# EasyEDA schematic Schemat_easy_eda.json
TITLE: Sheet_1; REV: 1.0; Date: 2021-04-07; Sheet: 1/1; Drawn By: student_try_240712; Company: Your Company
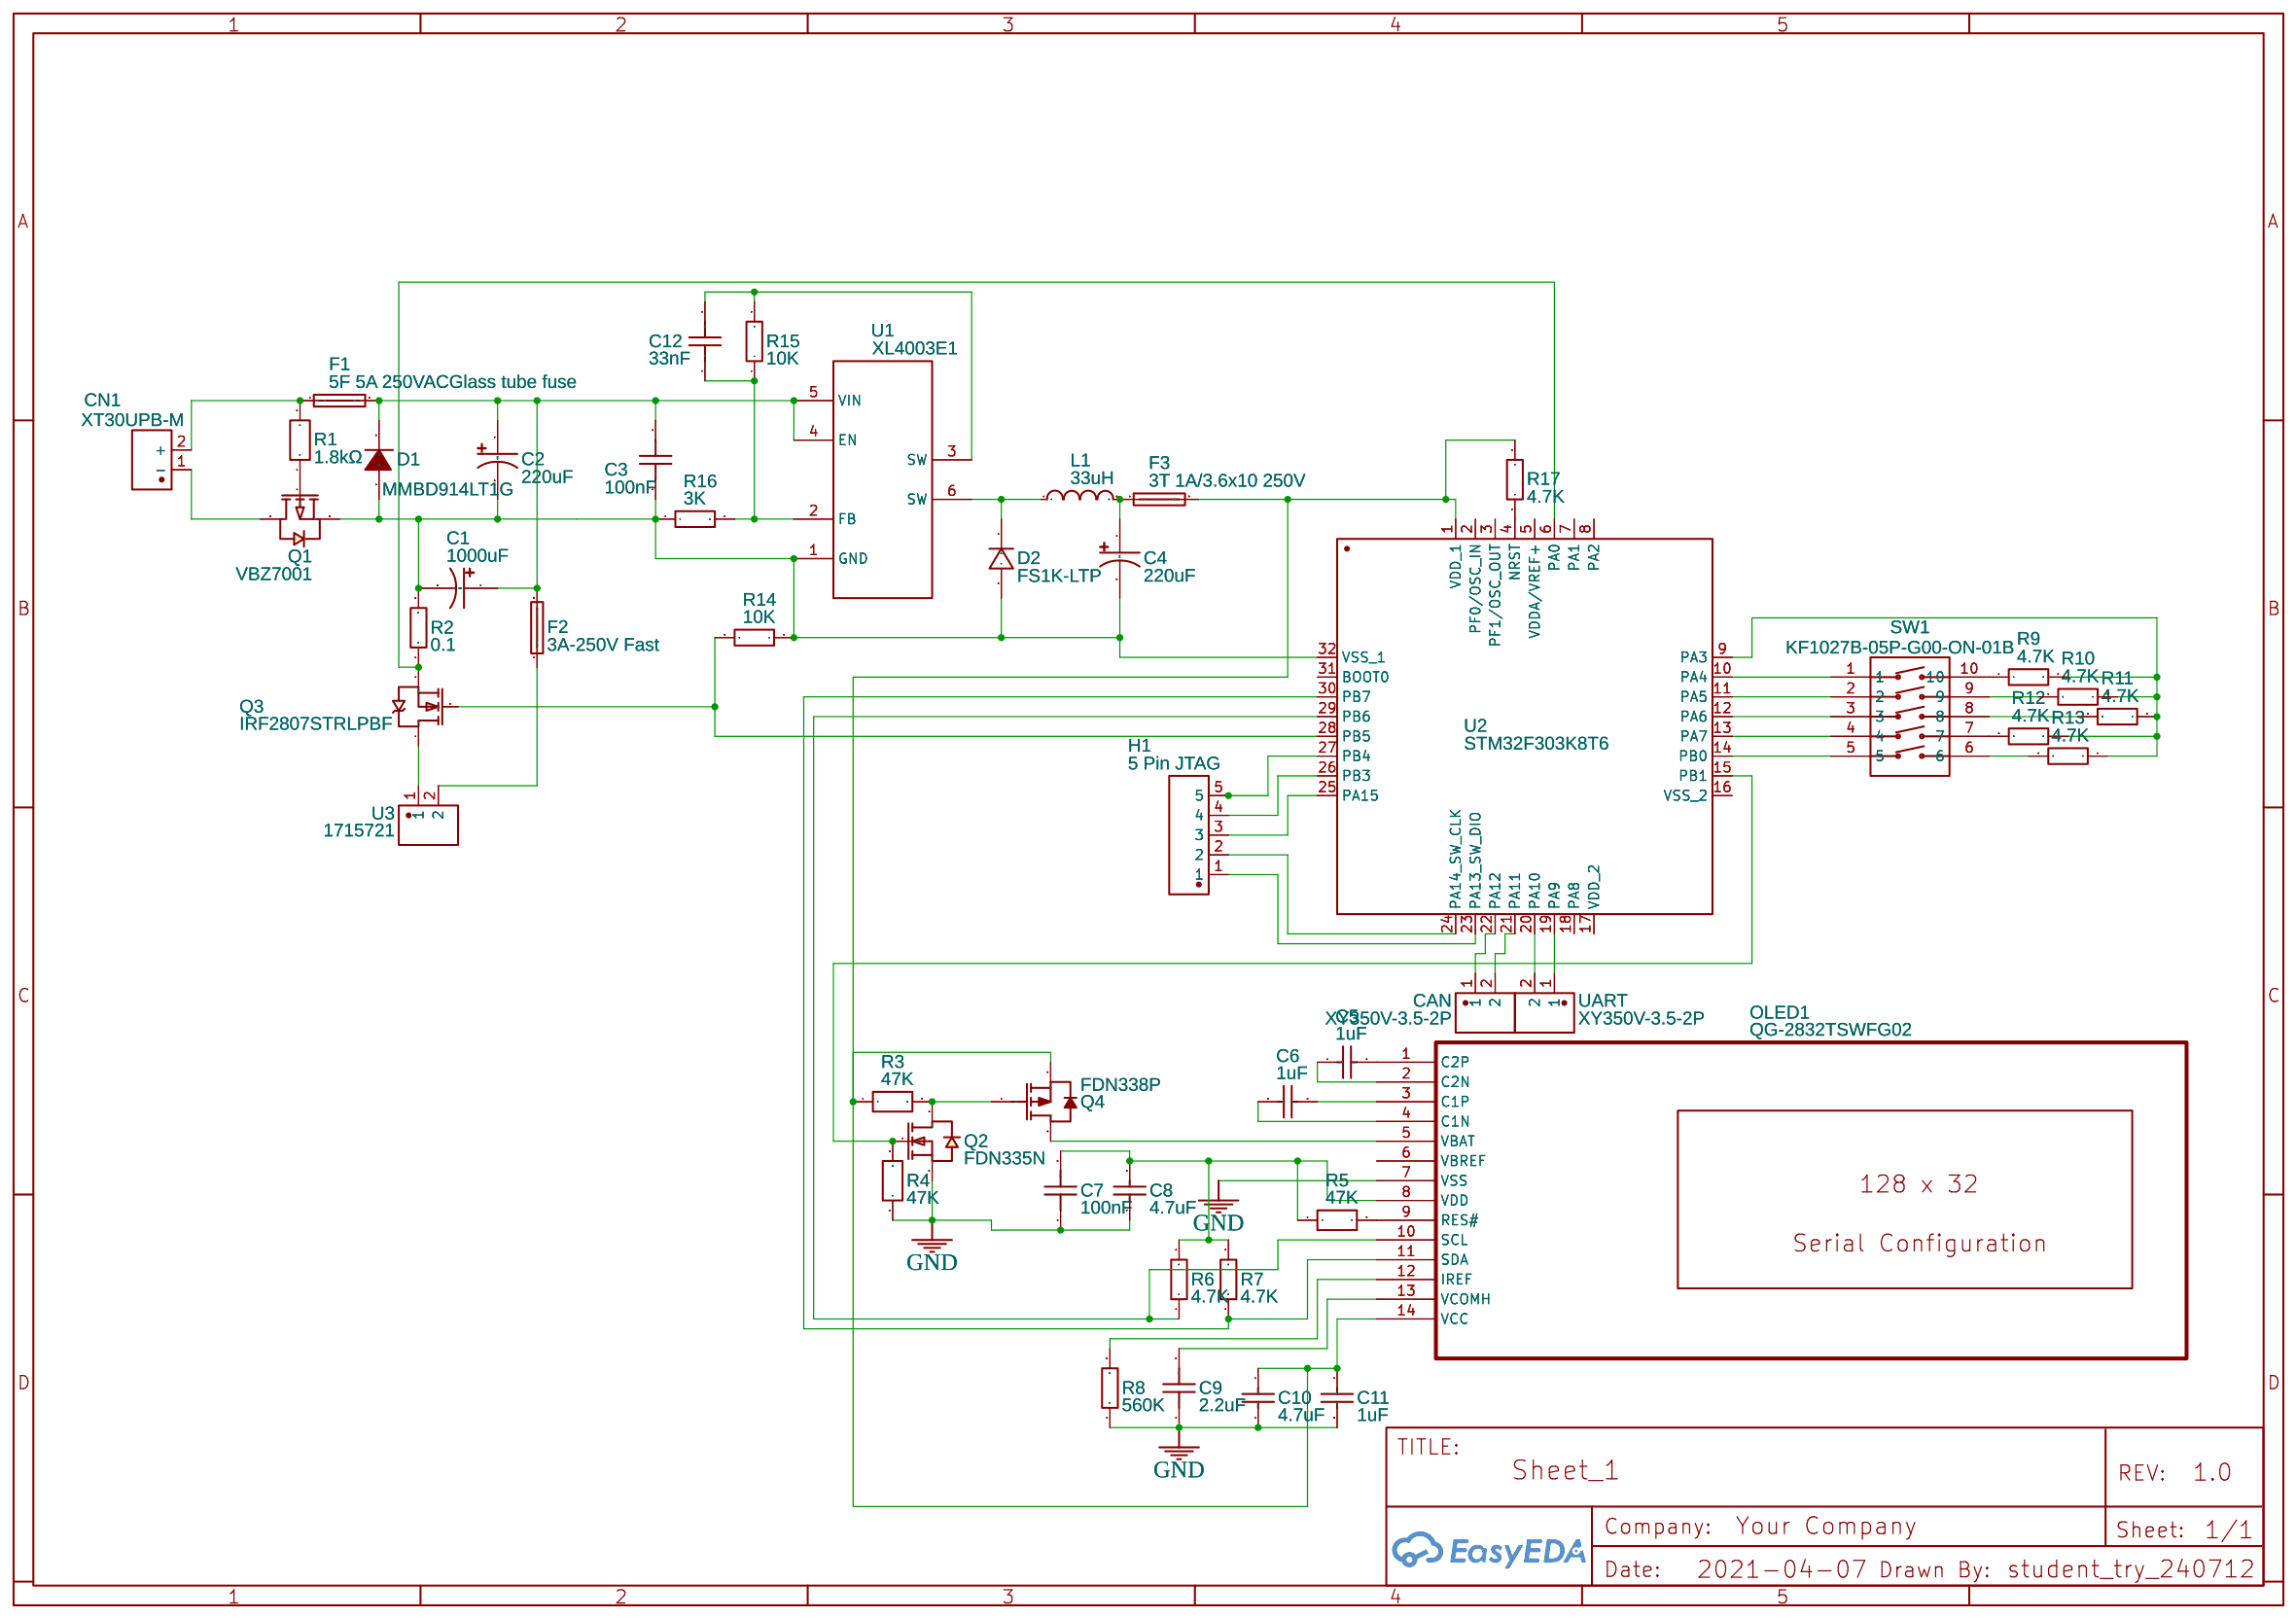
[diagram p0: schematic sheet]

## Parts
C1  1000uF  [CAP-TH_BD10.0-P5.00-D1.0-FD]
C2  220uF  [CAP-SMD_BD10.0-L10.3-W10.3-FD]
C3  100nF  [CAP-TH_L5.0-W2.5-P2.54-D0.7]
C4  220uF  [CAP-SMD_BD6.3-L6.6-W6.6-RD]
C5  1uF  [C0603]
C6  1uF  [C0603]
C7  100nF  [C0402]
C8  4.7uF  [C0805]
C9  2.2uF  [C0603]
C10  4.7uF  [C0805]
C11  1uF  [C0603]
C12  33nF  [CAP-TH_L7.2-W2.5-P5.00-D0.6]
CAN  XY350V-3.5-2P  [CONN-TH_XY350V-3.5-2P]
CN1  XT30UPB-M  [CONN-TH_XT30UPB-M]
D1  MMBD914LT1G  [SOT-23_L2.9-W1.3-P1.90-LS2.4-BR]
D2  FS1K-LTP  [SMA_L4.4-W2.8-LS5.4-RD]
F1  5F 5A 250VACGlass tube fuse  [FUSE-SMD_5-20MM]
F2  3A-250V Fast  [FUSE-TH_BD5.6-L21.0-P25.00-D0.7]
F3  3T 1A/3.6x10 250V  [FUSE-TH_BD4.0-L11.0-P15.00-D0.6]
H1  5 Pin JTAG  [HDR-TH_5P-P2.54-V-M]
L1  33uH  [IND-TH_BD9.0-P3.50-D0.6_VL0810]
OLED1  QG-2832TSWFG02  [OLED-SMD_QG-2832XXX]
Q1  VBZ7001  [SOT-23-3_L2.9-W1.3-P1.90-LS2.4-BR]
Q2  FDN335N  [SOT-23-3_L2.9-W1.3-P1.90-LS2.4-BR]
Q3  IRF2807STRLPBF  [TO-263-2_L10.0-W9.1-P5.08-LS15.2-BR]
Q4  FDN338P  [SOT-23-3_L2.9-W1.6-P1.90-LS2.8-BR]
R1  1.8kΩ  [RES-TH_BD2.5-L6.5-P10.50-D0.6]
R2  0.1  [R2512]
R3  47K  [RES-TH_BD2.4-L6.3-P10.30-D0.6]
R4  47K  [RES-TH_BD2.4-L6.3-P10.30-D0.6]
R5  47K  [RES-TH_BD2.4-L6.3-P10.30-D0.6]
R6  4.7K  [R0402]
R7  4.7K  [R0402]
R8  560K  [R0603]
R9  4.7K  [R0402]
R10  4.7K  [R0402]
R11  4.7K  [R0402]
R12  4.7K  [R0402]
R13  4.7K  [R0402]
R14  10K  [R0402]
R15  10K  [R1210]
R16  3K  [R0603]
R17  4.7K  [R0402]
SW1  KF1027B-05P-G00-ON-01B  [SW-SMD_10P-L13.7-W6.2-P2.54-LS9.9]
U1  XL4003E1  [TO-252-5_L6.6-W5.8-P1.27-TL]
U2  STM32F303K8T6  [LQFP-32_L7.0-W7.0-P0.80-LS9.0-BL]
U3  1715721  [CONN-TH_P5.08_1715721]
UART  XY350V-3.5-2P  [CONN-TH_XY350V-3.5-2P]

## Library data of the parts
C1 = LKME2301V102MF: Supplier: LCSC; Supplier Part: C442887; Manufacturer: Ymin; Contributor: LCSC; LCSC Assembly: Yes; SMT Type: Extend; Paste Type: expand
C2 = RVE1V221M1010: Supplier: LCSC; Manufacturer: HONOR; Supplier Part: C88670
C3 = CC1H104ZA1FD3F5P10MF: Supplier: LCSC; Supplier Part: C254089; Manufacturer: Dersonic; Contributor: LCSC; LCSC Assembly: Yes; SMT Type: Extend; Paste Type: expand
C4 = VE-221M0JTR-0605: Supplier: LCSC; Supplier Part: C134730; Manufacturer: Lite-On Semicon; Contributor: LCSC; SMT Type: Extend; JLCPCB SMD: Yes; LCSC Assembly: Yes; Paste Type: expand
C5 C6 C11 = CL10B105KA8NNNC: Supplier: LCSC; Manufacturer: SAMSUNG; Supplier Part: C29936; SMT Type: Extend; JLCPCB SMD: Yes; LCSC Assembly: Yes; Paste Type: expand
C7 = GRM155F11C104ZA01D: Supplier: LCSC; Manufacturer: MuRata; Supplier Part: C85954
C8 C10 = C2012X7R1A475KT000N: Supplier: LCSC; Manufacturer: TDK; Supplier Part: C76639
C9 = GRM188R6YA225KA12D: Supplier: LCSC; Manufacturer: MuRata; Supplier Part: C86017
C12 = SMEC333J100M1: Supplier: LCSC; Supplier Part: C401102; Manufacturer: CHAMPION; Contributor: LCSC; LCSC Assembly: Yes; SMT Type: Extend; Paste Type: expand
CAN UART = XY350V-3.5-2P: Supplier: LCSC; Supplier Part: C784942; Manufacturer: Ningbo Xinlaiya Elec.; Contributor: LCSC; LCSC Assembly: Yes; SMT Type: Extend; Paste Type: expand
CN1 = XT30UPB-M: Supplier: LCSC; Supplier Part: C428721; Manufacturer: Changzhou Amass Elec; Contributor: LCSC; LCSC Assembly: Yes; SMT Type: Extend; Paste Type: expand
D1 = MMBD914LT1G: Supplier: LCSC; Manufacturer: ON; image: //image.lceda.cn/szlcsc/C46523.jpg; Supplier Part: C46523; SMT Type: Extend; JLCPCB SMD: Yes; Paste Type: expand
D2 = FS1K-LTP: Supplier: LCSC; Supplier Part: C725310; Manufacturer: MCC(Micro Commercial Components); SMT Type: Extend; Contributor: LCSC; JLCPCB SMD: Yes; LCSC Assembly: Yes; Paste Type: expand
F1 = 5F 5A 250VACGlass tube fuse: Supplier: LCSC; Manufacturer: XCFuse; image: //image.lceda.cn/szlcsc/C3120.jpg; Supplier Part: C3120
F2 = 3A-250V: Supplier: LCSC; Manufacturer Part: 保险管3A-250V,带引脚 双帽; Manufacturer: XCFuse; Supplier Part: C47403; LCSC Assembly: Yes; SMT Type: Extend; Paste Type: expand
F3 = 3T 1A/3.6x10 250V: Supplier: LCSC; Manufacturer: XCFuse; image: //image.lceda.cn/szlcsc/C40879.jpg; Supplier Part: C40879; LCSC Assembly: Yes; SMT Type: Extend; Paste Type: expand
H1 = 210-81-05GB01: Supplier: LCSC; Supplier Part: C390676; Manufacturer: PINREX; Contributor: LCSC; Paste Type: expand
L1 = VLU0810-330K: Supplier: LCSC; Manufacturer: FH; Supplier Part: C72622; LCSC Assembly: Yes; SMT Type: Extend; Paste Type: expand
OLED1 = QG-2832TSWFG02: Supplier: LCSC; Manufacturer: Allvision; Supplier Part: C91219
Q1 = VBZ7001: Supplier: LCSC; Supplier Part: C699531; Manufacturer: VBsemi(台湾微碧); Paste Type: Extended Part; JLCPCB Part Class: Extended Part; Contributor: LCSC
Q2 = FDN335N: Supplier: LCSC; Supplier Part: C347512; Manufacturer: UMW(友台半导体); Contributor: LCSC
Q3 = IRF2807STRLPBF: Supplier: LCSC; Supplier Part: C97742; Manufacturer: Infineon Technologies; Contributor: LCSC; SMT Type: Extend; JLCPCB SMD: Yes; LCSC Assembly: Yes; Paste Type: expand
Q4 = FDN338P: Supplier: LCSC; Manufacturer: FAIRCHILD; Supplier Part: C24855; SMT Type: Extend; JLCPCB SMD: Yes; LCSC Assembly: Yes; Paste Type: expand
R1 = CF1/4W-1.8KΩ±5%T52: Supplier: LCSC; Supplier Part: C714304; Manufacturer: Huaxing Mechanical-Elec.; Contributor: LCSC
R2 = MRF6432(2512)LR100JTS: Supplier: LCSC; Manufacturer: SUP; Supplier Part: C76282; SMT Type: Extend; JLCPCB SMD: Yes; LCSC Assembly: Yes; Paste Type: expand
R3-R5 = RN 1/4W 47K F T/B A1: Supplier: LCSC; Supplier Part: C410613; Manufacturer: TyoHM; Contributor: LCSC; LCSC Assembly: Yes; SMT Type: Extend; Paste Type: expand
R6 R7 R9-R13 R17 = RM04JTN472: Supplier: LCSC; Manufacturer: TA-I; Contributor: LCSC; Supplier Part: C147813
R8 = AECR0603F560KK9: Supplier: LCSC; Supplier Part: C352308; Manufacturer: ResistorToday; Contributor: LCSC
R14 = NQ02WGF1002TCE: Supplier: LCSC; Supplier Part: C270381; Manufacturer: Uniroyal Elec; Contributor: LCSC; SMT Type: Extend; JLCPCB SMD: Yes; LCSC Assembly: Yes; Paste Type: expand
R15 = 1210W3J0103T5E: Supplier: LCSC; Manufacturer: UniOhm; Supplier Part: C25672; Paste Type: expand
R16 = 0603WAJ0302T5E: Supplier: LCSC; Manufacturer: UniOhm; Supplier Part: C25597; Paste Type: expand
SW1 = KF1027B-05P-G00-ON-01B: Supplier: LCSC; Supplier Part: C976367; Manufacturer: 凯峰; Contributor: LCSC
U1 = XL4003E1: Supplier: LCSC; Manufacturer: XLSEMI; image: //image.lceda.cn/szlcsc/C55888.jpg; Supplier Part: C55888; Paste Type: expand
U2 = STM32F303K8T6: Supplier: LCSC; Manufacturer: STMicroelectronics; Supplier Part: C118318; SMT Type: Extend; JLCPCB SMD: Yes; LCSC Assembly: Yes; Paste Type: expand
U3 = 1715721: Supplier: LCSC; Supplier Part: C480516; Manufacturer: Phoenix Contact; Contributor: LCSC; LCSC Assembly: Yes; SMT Type: Extend; Paste Type: expand

## Nets
GND: C7.1 C8.1 C9.1 C10.1 C11.1 OLED1.7(VSS) Q2.2(S) R4.1 R8.1
Net-(C1-1): C1.1 C2.1 C3.2 D1.3(K) F1.2 F2.2 U1.4(EN) U1.5(VIN)
Net-(C1-2): C1.2 C2.2 C3.1 C4.2 D1.1(A) D2.2(A) Q1.2(S) R2.2 R14.1 R16.1 U1.1(GND) U2.32(VSS_1)
Net-(C4-1): C4.1 F3.1 L1.2
Net-(C5-1): C5.1 OLED1.2(C2N)
Net-(C5-2): C5.2 OLED1.1(C2P)
Net-(C6-1): C6.1 OLED1.4(C1N)
Net-(C6-2): C6.2 OLED1.3(C1P)
Net-(C7-2): C7.2 C8.2 OLED1.8(VDD) R5.1 R6.2 R7.2
Net-(C9-2): C9.2 OLED1.13(VCOMH)
Net-(C10-2): C10.2 C11.2 F3.2 OLED1.14(VCC) Q4.2(S) R3.1 R17.2 U2.1(VDD)
Net-(C12-1): C12.1 R15.1 R16.2 U1.2(FB)
Net-(C12-2): C12.2 R15.2 U1.3(SW)
Net-(CAN-1): CAN.1 U2.22(PA12)
Net-(CAN-2): CAN.2 U2.21(PA11)
Net-(CN1-1): CN1.1(-) Q1.3(D)
Net-(CN1-2): CN1.2(+) F1.1 R1.2
Net-(D2-1): D2.1(C) L1.1 U1.6(SW)
Net-(F2-1): F2.1 U3.2
Net-(H1-1): H1.1 U2.23(PA13 SW DIO)
Net-(H1-2): H1.2 U2.24(PA14 SW CLK)
Net-(H1-3): H1.3 U2.25(PA15)
Net-(H1-4): H1.4 U2.26(PB3)
Net-(H1-5): H1.5 U2.27(PB4)
Net-(OLED1-5): OLED1.5(VBAT) Q4.3(D)
Net-(OLED1-9): OLED1.9(RES#) R5.2
Net-(OLED1-10): OLED1.10(SCL) R6.1 U2.29(PB6)
Net-(OLED1-11): OLED1.11(SDA) R7.1 U2.30(PB7)
Net-(OLED1-12): OLED1.12(IREF) R8.2
Net-(Q1-1): Q1.1(G) R1.1
Net-(Q2-1): Q2.1(G) R4.2 U2.15(PB1)
Net-(Q2-3): Q2.3(D) Q4.1(G) R3.2
Net-(Q3-1): Q3.1(G) R14.2 U2.28(PB5)
Net-(Q3-3): Q3.3(S) R2.1 U2.6(PA0)
Net-(Q3-4): Q3.4(D) U3.1
Net-(R9-1): R9.1 SW1.10
Net-(R9-2): R9.2 R10.1 R11.1 R12.1 R13.1 U2.9(PA3)
Net-(R10-2): R10.2 SW1.9
Net-(R11-2): R11.2 SW1.8
Net-(R12-2): R12.2 SW1.7
Net-(R13-2): R13.2 SW1.6
Net-(R17-1): R17.1 U2.4(NRST)
Net-(SW1-1): SW1.1 U2.10(PA4)
Net-(SW1-2): SW1.2 U2.11(PA5)
Net-(SW1-3): SW1.3 U2.12(PA6)
Net-(SW1-4): SW1.4 U2.13(PA7)
Net-(SW1-5): SW1.5 U2.14(PB0)
Net-(U2-19): U2.19(PA9) UART.1
Net-(U2-20): U2.20(PA10) UART.2

Not connected (* = marked no-connect by the designer): OLED1 6(VBREF); U2 2(PF0/OSC_IN) 3(PF1/OSC_OUT) 5(VDDA/VREF+) 7(PA1) 8(PA2) 16(VSS_2) 17(VDD_2) 18(PA8) 31(BOOT0)
